# Altium schematic sheet ControllableSource2.SchDoc
size A4; DocumentNumber: 2; SheetNumber: 2; SheetTotal: 2
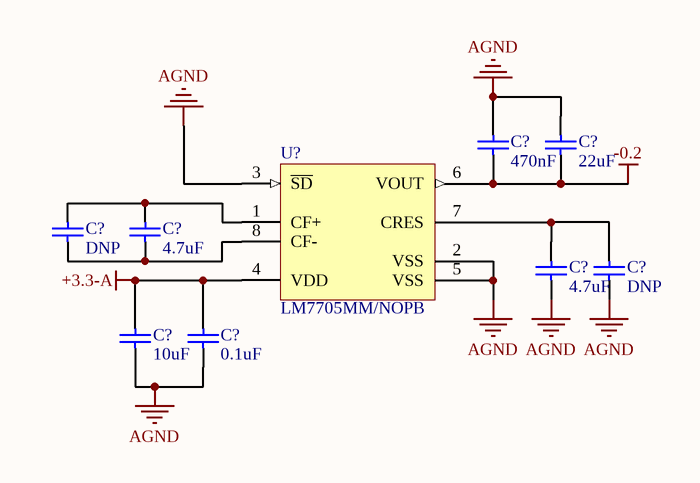
[diagram p0: ControllableSource2.SchDoc]

## Parts
(Parts that share a designator on the sheet are numbered #1, #2 ... from top to bottom, then left to right.)
C?#1  470nF  [0603_C]
C?#2  22uF  [0603_C]
C?#3  DNP  [0603_C]
C?#4  4.7uF  [0603_C]
C?#5  4.7uF  [0603_C]
C?#6  DNP  [0603_C]
C?#7  10uF  [0603_C]
C?#8  0.1uF  [0603_C]
U?  LM7705MM/NOPB  [DGK0008A_N]

## Nets
+3.3-A: C?#7.2 C?#8.2 U?.4(VDD)
-0.2: C?#1.1 C?#2.1 U?.6(VOUT)
AGND: C?#1.2 C?#2.2 C?#5.1 C?#6.1 C?#7.1 C?#8.1 U?.2(VSS) U?.3(~{SD}) U?.5(VSS)
NetC?#3_1: C?#3.1 C?#4.1 U?.8(CF-)
NetC?#3_2: C?#3.2 C?#4.2 U?.1(CF+)
NetC?#5_2: C?#5.2 C?#6.2 U?.7(CRES)

## Library data of the parts
C?#1-C?#8 = 0603 1uF (105) 10% 50V: 贴片电容; ComponentLink1Description: 供应商链接; ComponentLink1URL: http://www.szlcsc.com/product/details_16531.html; Package: 0603; Supplier: LC; SuppliersPartNumber: C15849
U? = CMP-0064-00158-3: Low Noise Negative Bias Generator, 8-pin Mini SOIC, Pb-Free; Manufacturer: Texas Instruments; PowerWise: N; CompType: OtherParts; PackageTopMarking: ZXTT*F26A; Code_JEDEC: MO-187-AA; ComponentLink1URL: http://www.ti.com/general/docs/lit/getliterature.tsp?genericPartNumber=LM7705&fileType=pdf; ComponentLink1Description: Datasheet URL; PackageDescription: MINI SOIC, .118 x .118 x .034in, 8 Lead, .0256in Pitch; RoHS: Y; PinCount: 8; PackageReference: DGK0008A